# EAGLE schematic ENC_CON (EAGLE 6.1)
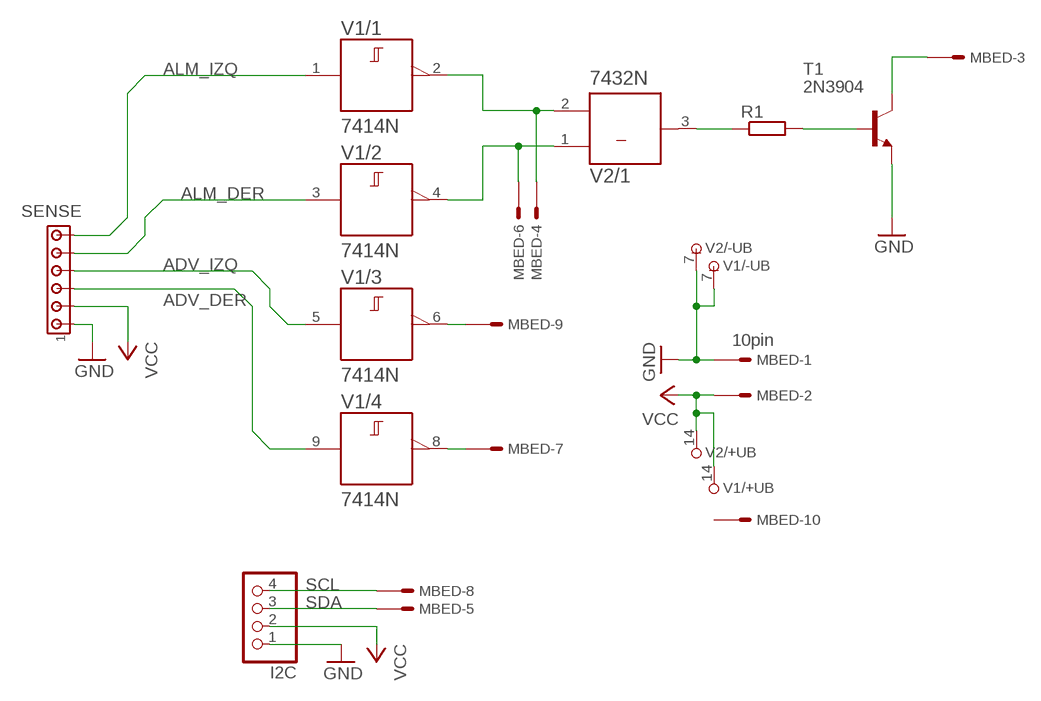
[diagram p0: schematic, sheet 1]

## Parts
I2C  PINHD-1X4/90  [1X04/90]
MBED  10pin  057-010-1  [057-010-1]
R1  R-EU_0207/10  [0207/10]
SENSE  MTA06-100  [10X06MTA]
T1  2N3904  [TO92]
V1  7414N  [DIL14]
V2  7432N  [DIL14]

## Nets
ADV_DER: SENSE.4 V1.9(/4:A)
ADV_IZQ: SENSE.3 V1.5(/3:A)
ALM_DER: SENSE.2 V1.3(/2:A)
ALM_IZQ: SENSE.1 V1.1(/1:A)
GND: I2C.1 MBED.1 SENSE.6 T1.3(E) V1.7(/-UB:-UB) V2.7(/-UB:-UB)
N$1: MBED.9 V1.6(/3:Y)
N$2: MBED.7 V1.8(/4:Y)
N$4: R1.1 V2.3(/1:Y)
N$6: MBED.4 V1.2(/1:Y) V2.2(/1:B)
N$7: MBED.6 V1.4(/2:Y) V2.1(/1:A)
N$9: R1.2 T1.2(B)
N$13: MBED.3 T1.1(C)
SCL: I2C.4 MBED.8
SDA: I2C.3 MBED.5
VCC: I2C.2 MBED.2 SENSE.5 V1.14(/+UB:+UB) V2.14(/+UB:+UB)
Unconnected: MBED.10 V1.10(/5:Y) V1.11(/5:A) V1.12(/6:Y) V1.13(/6:A) V2.4(/2:A) V2.5(/2:B) V2.6(/2:Y) V2.8(/3:Y) V2.9(/3:A) V2.10(/3:B) V2.11(/4:Y) V2.12(/4:A) V2.13(/4:B)

## Library data of the parts
I2C = pinhead:PINHD-1X4: PIN HEADER
MBED = con-panduit:057-010-: CONNECTOR 10-pin series 057 contact pc board low profile headers; OC_FARNELL: unknown; OC_NEWARK: unknown
R1 = rcl:R-EU_: RESISTOR, European symbol
SENSE = con-amp:MTA06-100: AMP connector
T1 = transistor:2N3904: NPN TRANSISTOR
V1 = 74ttl-din:74*14: Hex schmitt trigger INVERTER
V2 = 74ttl-din:74*32: Quad 2-input OR gate